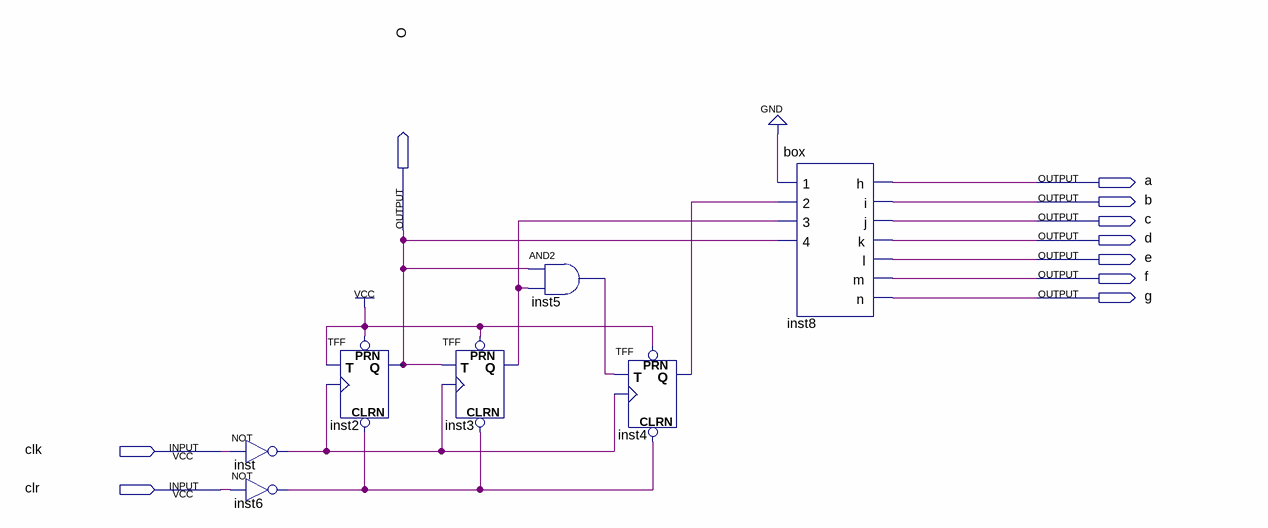
[diagram p0: schematic sheet]
// Quartus schematic bcd.bdf as structural Verilog: 7 symbols, 10 pins
module bcd (
  input  clk,
  input  clr,
  output a,
  output b,
  output c,
  output O,
  output d,
  output e,
  output f,
  output g
);

  wire inst3_q, inst4_q, inst5_out, inst6_out, inst_out;

  not inst (inst_out, clk);
  not inst6 (inst6_out, clr);
  TFF inst2 (.PRN(1'b1), .CLRN(inst6_out), .T(1'b1), .CLK(inst_out), .Q(O));
  TFF inst3 (.PRN(1'b1), .CLRN(inst6_out), .T(O), .CLK(inst_out), .Q(inst3_q));
  and inst5 (inst5_out, O, inst3_q);
  TFF inst4 (.PRN(1'b1), .CLRN(inst6_out), .T(inst5_out), .CLK(inst_out), .Q(inst4_q));
  box inst8 (.\1 (1'b0), .\2 (inst4_q), .\3 (inst3_q), .\4 (O), .h(a), .i(b), .j(c), .k(d), .l(e), .m(f), .n(g));
endmodule
